# EAGLE schematic NCP1200 (EAGLE 6.2)
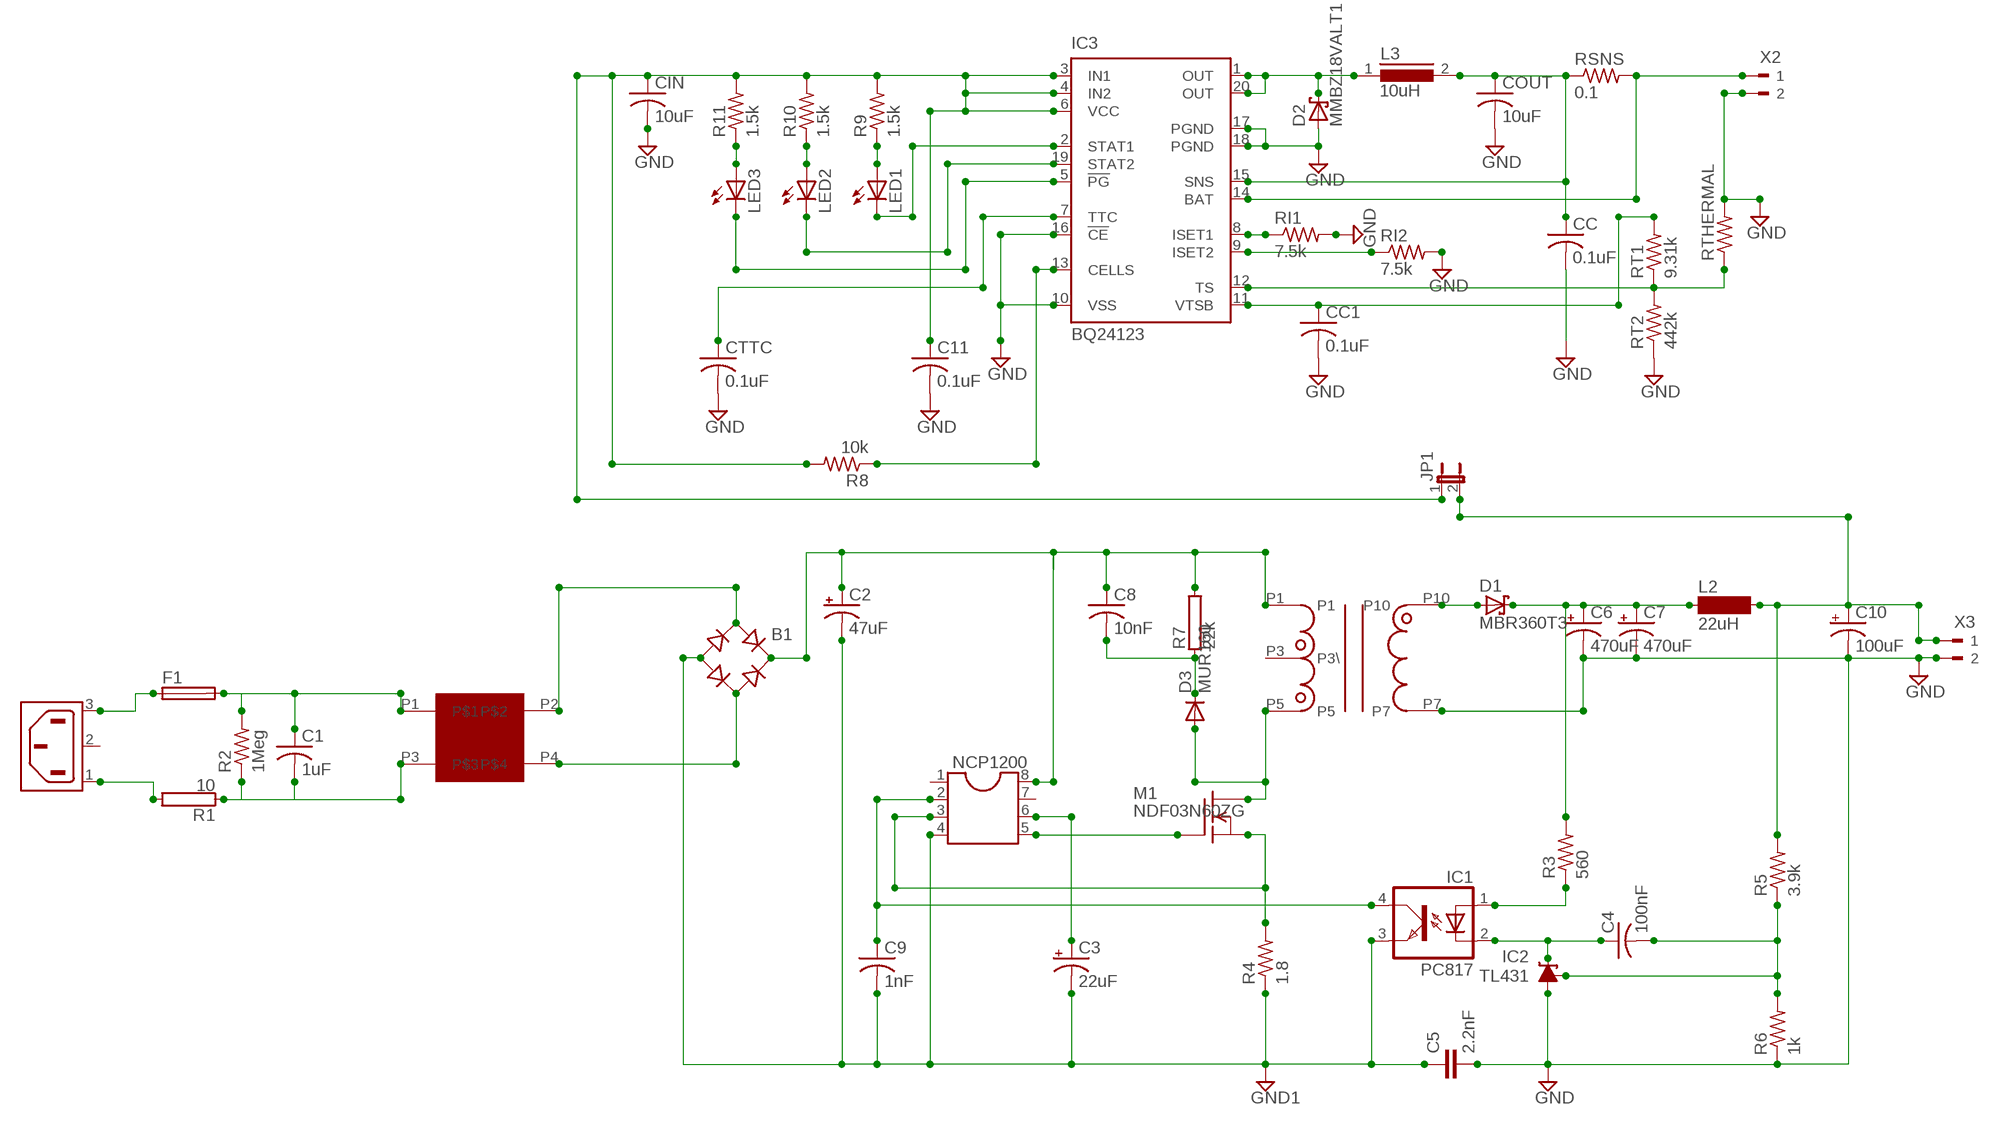
[diagram p0: schematic, sheet 1]

## Parts
B1  B-DIL  [B-DIL]
C1  1uF  C-US150-091X182  [C150-091X182]
C2  47uF  CPOL-USE10-22.5  [EB22,5D]
C3  22uF  CPOL-USE5-5  [E5-5]
C4  100nF  C-USC0805  [C0805]
C5  2.2nF  CYYC10B4  [YC10B4]
C6  470uF  CPOL-USE5-10.5  [E5-10,5]
C7  470uF  CPOL-USE5-10.5  [E5-10,5]
C8  10nF  C-US102-064X133  [C102-064X133]
C9  1nF  C-USC0805  [C0805]
C10  100uF  CPOL-USE2.5-6  [E2,5-6]
C11  0.1uF  C-USC0805  [C0805]
CC  0.1uF  C-USC0805  [C0805]
CC1  0.1uF  C-USC0805  [C0805]
CIN  10uF  C-USC0805  [C0805]
COUT  10uF  C-USC0805  [C0805]
CTTC  0.1uF  C-USC0805  [C0805]
D1  MBR360T3  MBRS130LT3  [SMB]
D2  MMBZ18VALT1  1N5908  [C4111-15]
D3  MUR160  BY203  [SGA-10]
F1  SH25  [SH25]
IC1  PC817  [DIL04]
IC2  TL431  LM4041BILP  [LP_O-PBCY-W3]
IC3  BQ24123  [QFN20_3,5X4,5]
JP1  JP1E  [JP1]
L2  22uH  SD8  [SD8]
L3  10uH  DR73  [DR73]
LED1  SFH482  [SFH482]
LED2  SFH482  [SFH482]
LED3  SFH482  [SFH482]
M1  NDF03N60ZG  BUZ20  [TO220]
NCP1200  DIL8  [DIL08]
R1  10  RKH206-8  [KH206-8]
R2  1Meg  R-US_R0805  [R0805]
R3  560  R-US_R0805  [R0805]
R4  1.8  R-US_R1206  [R1206]
R5  3.9k  R-US_R0805  [R0805]
R6  1k  R-US_R0805  [R0805]
R7  22k  RKH206-8  [KH206-8]
R8  10k  R-US_R0805  [R0805]
R9  1.5k  R-US_R0805  [R0805]
R10  1.5k  R-US_R0805  [R0805]
R11  1.5k  R-US_R0805  [R0805]
RI1  7.5k  R-US_R0805  [R0805]
RI2  7.5k  R-US_R0805  [R0805]
RSNS  0.1  R-US_R1206  [R1206]
RT1  9.31k  R-US_R0805  [R0805]
RT2  442k  R-US_R0805  [R0805]
RTHERMAL  R-US_R0805  [R0805]
U$1  RENCO1  [RENCO1]
U$2  L1CHO5  [L1CHO]
X1  6ESRM-P  [6ESRM-P]
X2  90-2  [90-2]
X3  90-2  [90-2]

## Nets
GND: C5.2 C6.- C7.- C10.- C11.2 CC1.2 CC.2 CIN.2 COUT.2 CTTC.2 D2.A IC2.3(A) IC3.10(VSS) IC3.16(!CE) IC3.17(PGND) IC3.18(PGND) R6.1 RI1.2 RI2.2 RT2.1 RTHERMAL.2 U$1.P7 X2.2 X3.2
N$1: D2.C IC3.1(OUT) IC3.20(OUT) L3.1
N$2: C1.2 R1.1 R2.1 U$2.P3
N$3: CC.1 COUT.1 IC3.15(SNS) L3.2 RSNS.1
N$4: B1.AC1 U$2.P2
N$5: B1.AC2 U$2.P4
N$6: IC3.8(ISET1) RI1.1
N$7: B1.+ C2.+ C8.1 NCP1200.8 R7.2 U$1.P1
N$8: C9.1 IC1.4(COL) NCP1200.2
N$9: M1.1(G) NCP1200.5
N$10: M1.3(S) NCP1200.3 R4.2
N$11: C3.+ NCP1200.6
N$12: C11.1 CIN.1 IC3.3(IN1) IC3.4(IN2) IC3.6(VCC) JP1.1 R8.2 R9.2 R10.2 R11.2
N$13: D1.A U$1.P10
N$14: C8.2 D3.C R7.1
N$15: D3.A M1.2(D) U$1.P5
N$16: C6.+ C7.+ D1.C L2.1 R3.2
N$17: IC1.1(A) R3.1
N$18: IC3.9(ISET2) RI2.1
N$19: C4.2 IC2.1(FB) R5.1 R6.2
N$20: C4.1 IC1.2(C) IC2.2(C)
N$21: IC3.12(TS) RT1.1 RT2.2 RTHERMAL.1
N$22: CC1.1 IC3.11(VTSB) RT1.2
N$23: LED3.A R11.1
N$24: LED2.A R10.1
N$25: LED1.A R9.1
N$26: IC3.2(STAT1) LED1.K(C)
N$27: IC3.19(STAT2) LED2.K(C)
N$28: IC3.5(!PG) LED3.K(C)
N$29: CTTC.1 IC3.7(TTC)
N$30: IC3.13(CELLS) R8.1
N$31: C1.1 F1.2 R2.2 U$2.P1
N$32: R1.2 X1.1(AC1)
N$33: IC3.14(BAT) RSNS.2 X2.1
N$34: F1.1 X1.3(AC2)
N$35: C10.+ JP1.2 L2.2 R5.2 X3.1
PE: B1.- C2.- C3.- C5.1 C9.2 IC1.3(EMIT) NCP1200.4 R4.1 ; supply symbol labelled GND1
Unconnected: IC3.EXP IC3.EXP@1 IC3.EXP@2 IC3.EXP@3 IC3.EXP@4 IC3.EXP@5 IC3.EXP@6 IC3.EXP@7 IC3.EXP@8 IC3.EXP@9 IC3.EXP@10 IC3.EXP@11 IC3.EXP@12 NCP1200.1 NCP1200.7 U$1.P3(P3\) X1.2(SH)

## Library data of the parts
B1 = rectifier:B-DIL: RECTIFIER
C1 C4 C8 C9 C11 CC CC1 CIN COUT CTTC = resistor:C-US: CAPACITOR, American symbol
C2 C3 C6 C7 C10 = resistor:CPOL-US: POLARIZED CAPACITOR, American symbol
C5 = resistor:CY: Y CAPACITOR for power line
D1 = diode:MBRS130LT3: Schottky Power Rectifier Source: http://www.onsemi.com/pub/Collateral/MBRS130LT3-D.PDF
D2 = diode:1N5908: DIODE schottky
D3 = diode:BY203: DIODE Si, 2 kV, 0.25 A, 300 ns
F1 = fuse:SH25: FUSE HOLDER grid 25 mm, OGN0031 8211, Schurter (Buerklin); MF: SCHURTER; MPN: 0031.8211; OC_FARNELL: 1162741; OC_NEWARK: 96B9380
IC1 = optocoupler:PC817: SHARP OPTO COUPLER; MPN: PC817X4J000F; OC_FARNELL: 9707727; OC_NEWARK: 97K7059
IC2 = texas:LM4041*I: PRECISION MICROPOWER SHUNT VOLTAGE REFERENCE Adjustable Output Source: http://focus.ti.com/lit/ds/slcs146e/slcs146e.pdf; OC_FARNELL: unknown; OC_NEWARK: unknown
IC3 = texas:BQ24123: SINGLE-CHIP SWITCHMODE, LI-ION AND LI-POLYMER CHARGE-MANAGEMENT IC WITH ENHANCED EMI PERFORMANCE(bqSWITCHER) Source: www.ti.com .. TI-bq24125.pdf; MPN: BQ24123RHLT; OC_FARNELL: 1407131; OC_NEWARK: 84K0851
JP1 = jumper:JP1E: JUMPER
L2 = inductor-neosid:SD8: INDUCTOR nominal inductance; OC_FARNELL: unknown; OC_NEWARK: unknown
L3 = inductors:DR73: High Power Density, High Efficiency, Shielded Inductors Source: coiltronics_dr_series.pdf
LED1-LED3 = led:SFH482: IR LED infrared emitting diode, Infineon
M1 = transistor-fet:BUZ20: N-Channel Enhancement MOSFET 100V; 12A; 0,2Ohm
NCP1200 = ic-package:DIL8: Dual In Line / Socket
R1 R7 = resistor-power:R: Power Resitor; OC_FARNELL: unknown; OC_NEWARK: unknown
R2-R6 R8-R11 RI1 RI2 RSNS RT1 RT2 RTHERMAL = resistor:R-US_: RESISTOR, American symbol
U$1 = renco:RENCO1
U$2 = l1choke:L1CHO5
X1 = con-tycoelectronics:6ESRM-P: AC Connector 120/250 VAC Source: http://catalog.tycoelectronics.com .. ENG_DS_1654001_1099_SR_0406.pdf; MF: TYCO ELECTRONICS; MPN: 6ESRM-P; OC_FARNELL: unknown; OC_NEWARK: 87F1821
X2 X3 = con-weidmueller-sl35:90-2: WEIDMUELLER CLAMP CONNECTOR; OC_FARNELL: unknown; OC_NEWARK: unknown